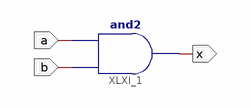
[diagram p0: schematic sheet 1]
// Xilinx ISE schematic my_and.sch (spartan3) as structural Verilog: 1 symbols, 3 ports
module my_and (
  input  b,
  input  a,
  output x
);

  and XLXI_1 (x, b, a);
endmodule
